# Altium schematic sheet Connection.SchDoc
size 241 x 152 mm; SheetNumber: 5; SheetTotal: 5
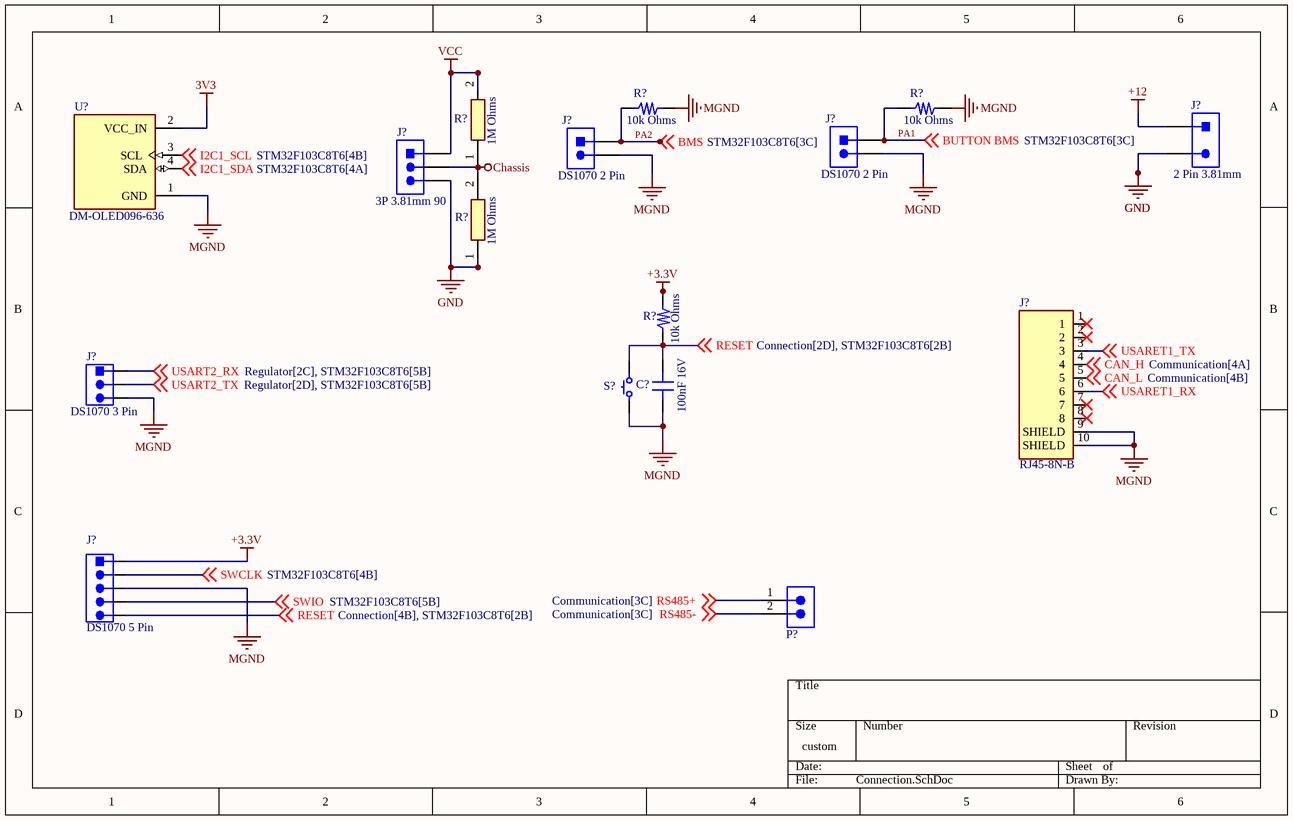
[diagram p0: Connection.SchDoc]

## Parts
(Parts that share a designator on the sheet are numbered #1, #2 ... from top to bottom, then left to right.)
C?  100nF 16V  [0603_CAP]
J?#1  2 Pin 3.81mm  [TB2_3.81MM]
J?#2  DS1070 2 Pin  [2PIN_100mil]
J?#3  DS1070 2 Pin  [2PIN_100mil]
J?#4  3P 3.81mm 90  [TB3_3.81_90C]
J?#5  RJ45-8N-B  [TE_RJ45-8N-B]
J?#6  DS1070 3 Pin  [3pin_100mil]
J?#7  DS1070 5 Pin  [PCBComponent_1 - duplicate]
P?  61300211121  [61300211121]  (value not drawn)
R?#1  10k Ohms  [0603_RES]
R?#2  10k Ohms  [0603_RES]
R?#3  1M Ohms  [RESC3216X75N]
R?#4  1M Ohms  [RESC3216X75N]
R?#5  10k Ohms  [0603_RES]
S?  DTSMF-31R-V-T/R  [Button]  (value not drawn)
U?  DM-OLED096-636  [MODULE_DM-OLED096-636]

## Nets
3V3: U?.2(VCC_IN)
+3.3V: J?#7.1 R?#5.1
+12: J?#1.1
Chassis: J?#4.2 R?#3.1 R?#4.2
GND: J?#1.2 J?#4.3 R?#4.1
MGND: C?.1 J?#2.2 J?#3.2 J?#5.9(SHIELD) J?#5.10(SHIELD) J?#6.3 J?#7.3 R?#1.1 R?#2.1 S?.1 U?.1(GND)
VCC: J?#4.1 R?#3.2
CAN_H: J?#5.4 ; off-sheet CAN_H
CAN_L: J?#5.5 ; off-sheet CAN_L
I2C1_SCL: U?.3(SCL) ; off-sheet I2C1_SCL
I2C1_SDA: U?.4(SDA) ; off-sheet I2C1_SDA
PA1: J?#3.1 R?#2.2 ; off-sheet BUTTON BMS  [also labelled BUTTON BMS]
PA2: J?#2.1 R?#1.2 ; off-sheet BMS  [also labelled BMS]
RESET: C?.2 J?#7.5 R?#5.2 S?.2 ; off-sheet RESET
RS485+: P?.1 ; off-sheet RS485+
RS485-: P?.2 ; off-sheet RS485-
SWCLK: J?#7.2 ; off-sheet SWCLK
SWIO: J?#7.4 ; off-sheet SWIO
USARET1_RX: J?#5.6 ; off-sheet USARET1_RX
USARET1_TX: J?#5.3 ; off-sheet USARET1_TX
USART2_RX: J?#6.1 ; off-sheet USART2_RX
USART2_TX: J?#6.2 ; off-sheet USART2_TX

Not connected (* = marked no-connect by the designer): J?#5 1* 2* 7* 8*

## Library data of the parts
C? = CAP_0603: CL10B105KO8NNNC - MLCC (1608) 0603 1uF 16VDC ±10% X7R; Value: 10nF 16V
J?#1 = TBLOCK2 3.81MM: 15EDGRC-3.81-02P-11-00AH - TERM.BLK.3.81MM 2P 90C MALE GRAY CLOSED; ComponentLink1Description: Özdisan; ComponentLink1URL: https://ozdisan.com/konnektor-ve-baglanti-elemanlari/klemensler/gecmeli-klemensler/15EDGRC-3-81-02P-11-00AH
J?#2 J?#3 = 2 Pin Socket: 2pin Socket 100mil
J?#4 = TB3_3.81MM_90C
J?#5 = RJ45-8N-B: RJ Jack / Signal Line EMI/RFI Filters 6 TERM LOW PROFILE BLOCK INDUCTOR 8 PIN; Price: None; Value: *; MP: RJ45-8N-B; Package: None; Availability: Unavailable
J?#6 = 3 Pin Socket: 3 Pin 100mm Connector; ComponentLink1Description: Özdisan; ComponentLink1URL: https://www.ozdisan.com/konnektor-ve-baglanti-elemanlari/konnektor-cesitleri/pcb-konnektorler/DS1070-3MVV6; Part: DS1070 3 Pin
J?#7 = 5 Pin Socket: 5pin Socket 100mil
P? = 61300211121: WR-PHD Pin Header, THT, Vertical, pitch 2.54mm, 1 Row, 2P; Manufacturer: Wurth Elektronik; Contact Resistance: 20mOhm; Rated Current: 3A; Working Voltage: 250V; Withstanding Voltage: 500V; Manufacturer Part Number: 61300211121; Category: Board-to-Board Connectors; Match Code: WR-PHD; ComponentLink1Description: Website Link; ComponentLink1URL: https://www.we-online.com/redexpert/article/61300211121?ad; ComponentLink2Description: Datasheet Link; ComponentLink2URL: https://www.we-online.com/redexpert/spec/61300211121?ad; Mount: Through Hole; Operating Temperature Max: 105°C; Operating Temperature Min: -40°C; Packaging: Bag; Gender: Pin Header; Number of Pins: 2; Number of Rows: 1; Orientation: Vertical; Pitch: 2.54mm
R?#1 R?#2 R?#5 = RES_0603: 0603; Power: 1/8W; Value: 10k Ohms
R?#3 R?#4 = Resistor: 1206 SMD Resistor; Manufacturer_Name: Bourns; Manufacturer_Part_Number: CR1206-F/-2R70ELF; Datasheet Link: https://mail.qq.com/cgi-bin/loginpage?autologin=n&errtype=1&clientuin=895793657&param=&sp=&tfcont=22%20serialization%3A%3Aarchive%2010%200%200%204%200%200%200%208%20authtype%201%204%209%20clientuin%209%20895793657%206%20domain%206%20qq.com%202%20vm%203%20; Height: 0.75mm; Mouser Part Number: 652-CR1206-F/2R70ELF; Mouser Price/Stock: https://www.mouser.co.uk/ProductDetail/Bourns/CR1206-F-2R70ELF?qs=W%2FMpXkg%252BdQ43a7iNS79Iog%3D%3D
S? = DTSMF-31R-V-T/R: DTSMF-31R-V-T/R - SWITCH TACT 6.00x3.50 4.30mm 260gF SMT V/T; ComponentLink1Description: özdisan; ComponentLink1URL: https://ozdisan.com/elektromekanik-komponentler/sivicler-ve-anahtarlar/tact-sivicler/DTSMF-31R-V-TR
U? = DM-OLED096-636: 0.96â€ 128 X 64 MONOCHROME GRAPHIC OLED DISPLAY MODULE - I2C; SnapEDA_Link: https://www.snapeda.com/parts/DM-OLED096-636/Display+Module/view-part/?ref=snap; Package: Package; Value: *; MF: Display Module; MP: DM-OLED096-636; Check_prices: https://www.snapeda.com/parts/DM-OLED096-636/Display+Module/view-part/?ref=eda